# EasyEDA schematic SCH_Schematic-Diagram-for-Motion-Control-System_2026-05-18.json
TITLE: Sheet_1; REV: 1.0; Date: 2026-05-18; Sheet: 1/1; Drawn By: sarthakninja; Company: Your Company
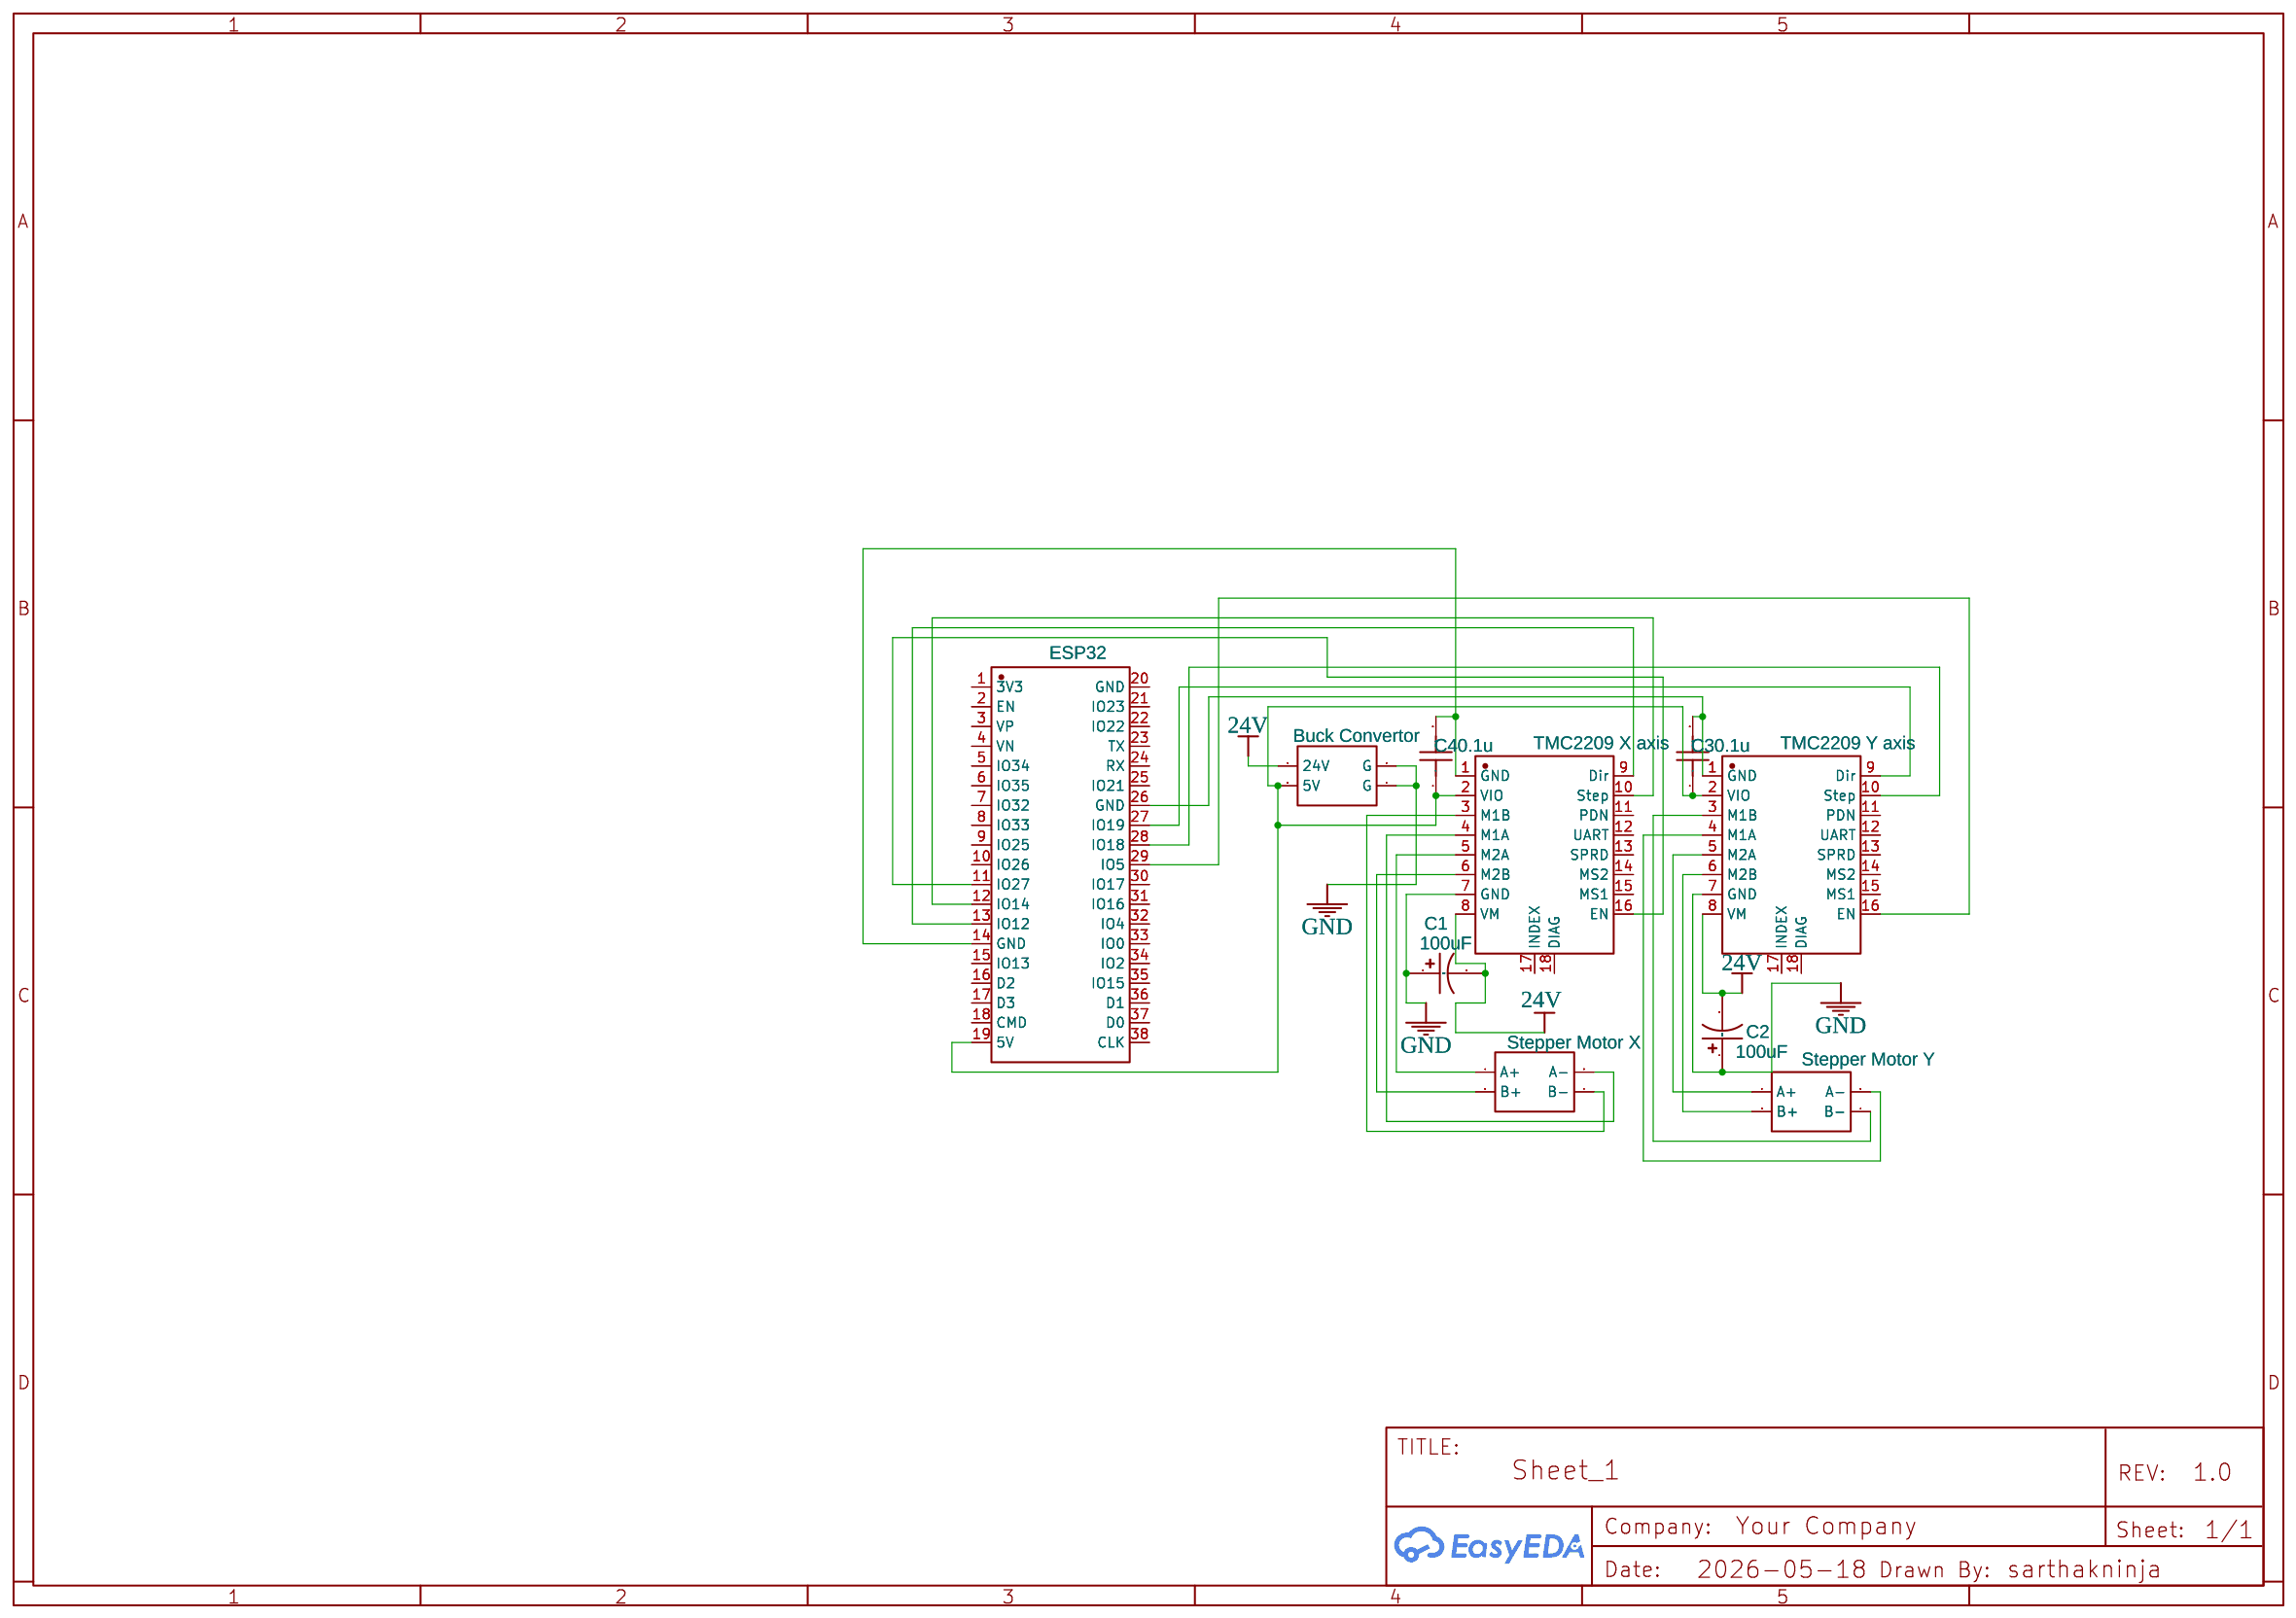
[diagram p0: schematic sheet]

## Parts
C1  100uF  [CASE-A_3216]
C2  100uF  [CASE-A_3216]
C3  0.1u  [C0603]
C4  0.1u  [C0603]
J1  Stepper Motor X  [HDR-M-2.54_2X2]
J2  Stepper Motor Y  [HDR-M-2.54_2X2]
J3  Buck Convertor  [HDR-M-2.54_2X2]
U1  ESP32  [BULETM-SMD_ESP32-DEVKITC]
U2  TMC2209 X axis  [COMM-TH_TMC2209SILENTSTEPSTICK]
U3  TMC2209 Y axis  [COMM-TH_TMC2209SILENTSTEPSTICK]

## Library data of the parts
C1 C2 = C_Tan_SMD_A_US: Contributor: LCEDA_Lib
C3 C4 = C_0603_US: Contributor: LCEDA_Lib
J1-J3 = HDR-M-2.54_2x2: Supplier Part: C66690; Supplier: LCSC; Contributor: LCEDA_Lib
U1 = ESP32-DEVKITC-VE: Supplier: LCSC; Supplier Part: C20437001; Manufacturer: ESPRESSIF(乐鑫); JLCPCB Part Class: Extended Part; Contributor: lcsc
U2 U3 = TMC2209SILENTSTEPSTICK: Supplier: LCSC; Supplier Part: C17375345; Manufacturer: TRINAMIC; JLCPCB Part Class: Extended Part; Contributor: lcsc

## Nets
24V: C1.2 C2.2 J3.1(24V) U2.8(VM) U3.8(VM)
GND: C1.1 C2.1 J3.2(G) J3.4(G) U2.7(GND) U3.7(GND)
Net-(C3-1): C3.1 C4.1 J3.3(5V) U1.19(5V) U2.2(VIO) U3.2(VIO)
Net-(C3-2): C3.2 U1.26(GND) U3.1(GND)
Net-(C4-2): C4.2 U1.14(GND) U2.1(GND)
Net-(J1-1): J1.1(A+) U2.5(M2A)
Net-(J1-2): J1.2(A-) U2.4(M1A)
Net-(J1-3): J1.3(B+) U2.6(M2B)
Net-(J1-4): J1.4(B-) U2.3(M1B)
Net-(J2-1): J2.1(A+) U3.5(M2A)
Net-(J2-2): J2.2(A-) U3.4(M1A)
Net-(J2-3): J2.3(B+) U3.6(M2B)
Net-(J2-4): J2.4(B-) U3.3(M1B)
Net-(U1-11): U1.11(IO27) U2.16(EN)
Net-(U1-12): U1.12(IO14) U2.10(Step)
Net-(U1-13): U1.13(IO12) U2.9(Dir)
Net-(U1-27): U1.27(IO19) U3.9(Dir)
Net-(U1-28): U1.28(IO18) U3.10(Step)
Net-(U1-29): U1.29(IO5) U3.16(EN)

Not connected (* = marked no-connect by the designer): U1 1(3V3) 2(EN) 3(VP) 4(VN) 5(IO34) 6(IO35) 7(IO32) 8(IO33) 9(IO25) 10(IO26) 15(IO13) 16(D2) 17(D3) 18(CMD) 20(GND) 21(IO23) 22(IO22) 23(TX) 24(RX) 25(IO21) 30(IO17) 31(IO16) 32(IO4) 33(IO0) 34(IO2) 35(IO15) 36(D1) 37(D0) 38(CLK); U2 11(PDN) 12(UART) 13(SPRD) 14(MS2) 15(MS1) 17(INDEX) 18(DIAG); U3 11(PDN) 12(UART) 13(SPRD) 14(MS2) 15(MS1) 17(INDEX) 18(DIAG)
